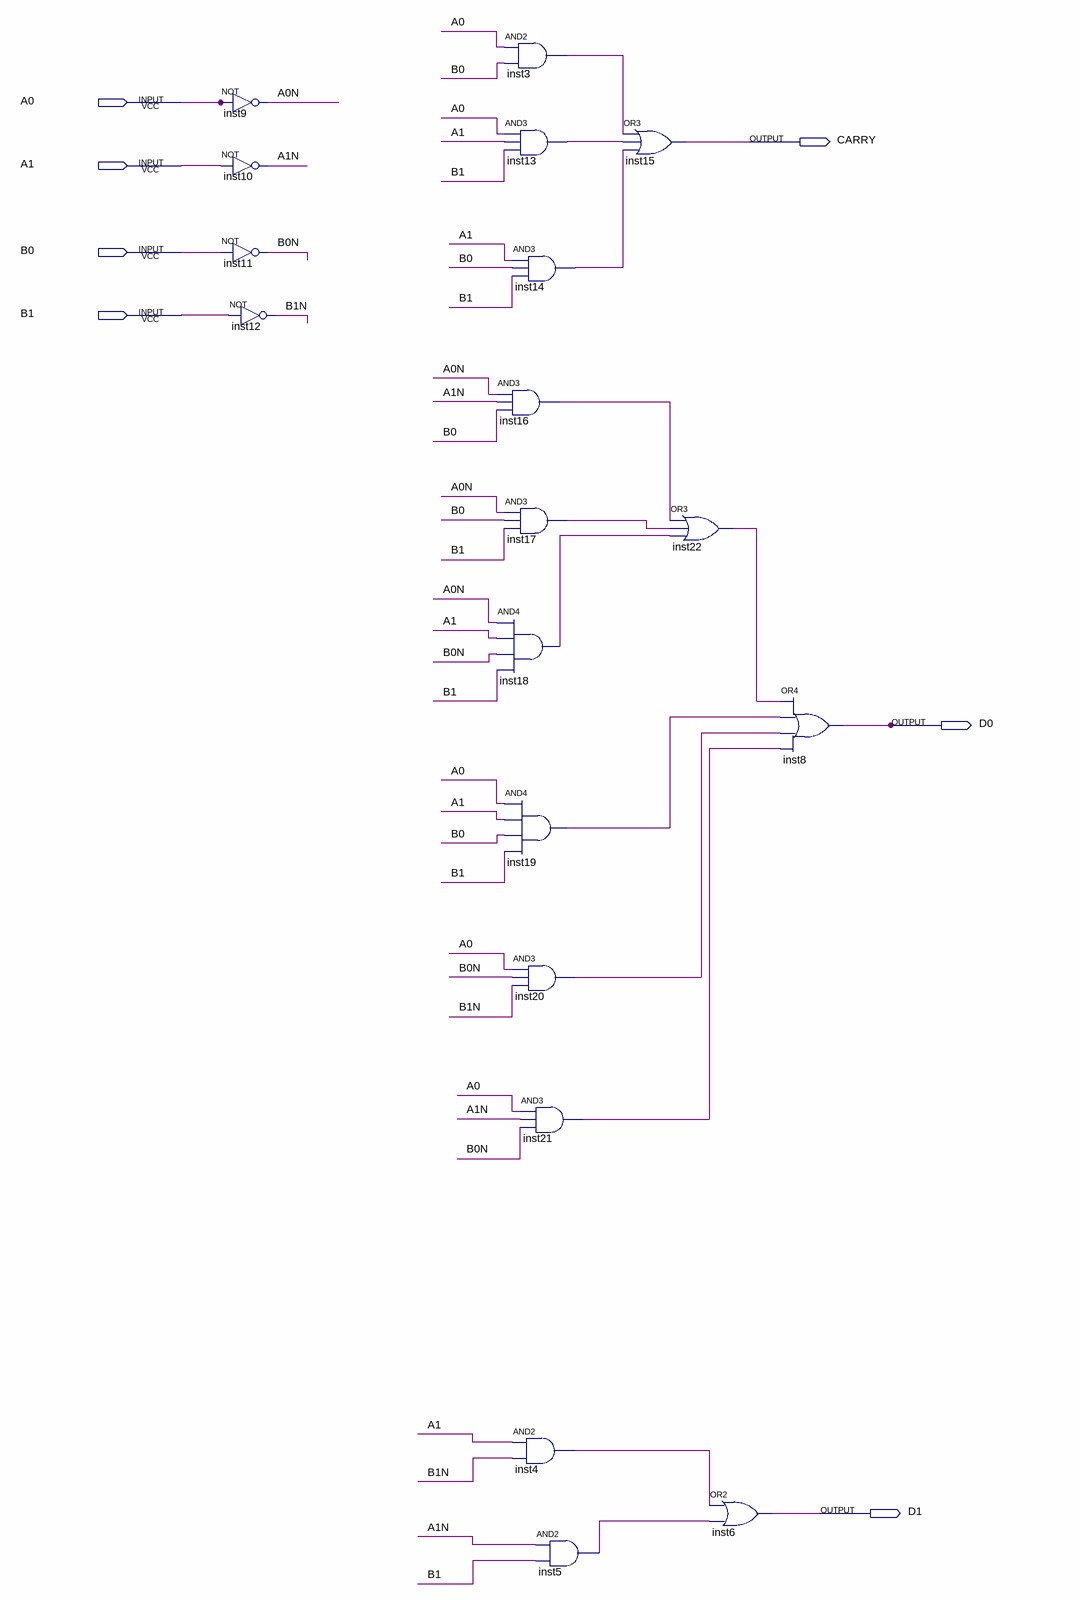
[diagram p0: schematic sheet]
// Quartus schematic TETRA_ADDER.bdf as structural Verilog: 19 symbols, 7 pins
module TETRA_ADDER (
  input  A0,
  input  A1,
  input  B0,
  input  B1,
  output CARRY,
  output D0,
  output D1
);

  wire A0N, A1N, B0N, B1N, inst3_out, inst4_out, inst5_out, inst13_out, inst14_out, inst16_out, inst17_out,
       inst18_out, inst19_out, inst20_out, inst21_out, inst22_out;

  not inst9 (A0N, A0);
  not inst10 (A1N, A1);
  not inst11 (B0N, B0);
  not inst12 (B1N, B1);
  and inst3 (inst3_out, A0, B0);
  and inst13 (inst13_out, A0, A1, B1);
  and inst14 (inst14_out, A1, B0, B1);
  and inst16 (inst16_out, A0N, A1N, B0);
  and inst17 (inst17_out, A0N, B0, B1);
  and inst18 (inst18_out, A0N, A1, B0N, B1);
  and inst19 (inst19_out, A0, A1, B0, B1);
  and inst20 (inst20_out, A0, B0N, B1N);
  and inst21 (inst21_out, A0, A1N, B0N);
  and inst4 (inst4_out, A1, B1N);
  and inst5 (inst5_out, A1N, B1);
  or inst15 (CARRY, inst3_out, inst13_out, inst14_out);
  or inst22 (inst22_out, inst16_out, inst17_out, inst18_out);
  or inst6 (D1, inst4_out, inst5_out);
  or inst8 (D0, inst22_out, inst19_out, inst20_out, inst21_out);
endmodule
